# Altium schematic sheet GPIO.SchDoc
size 457 x 457 mm; SheetNumber: 8; SheetTotal: 12
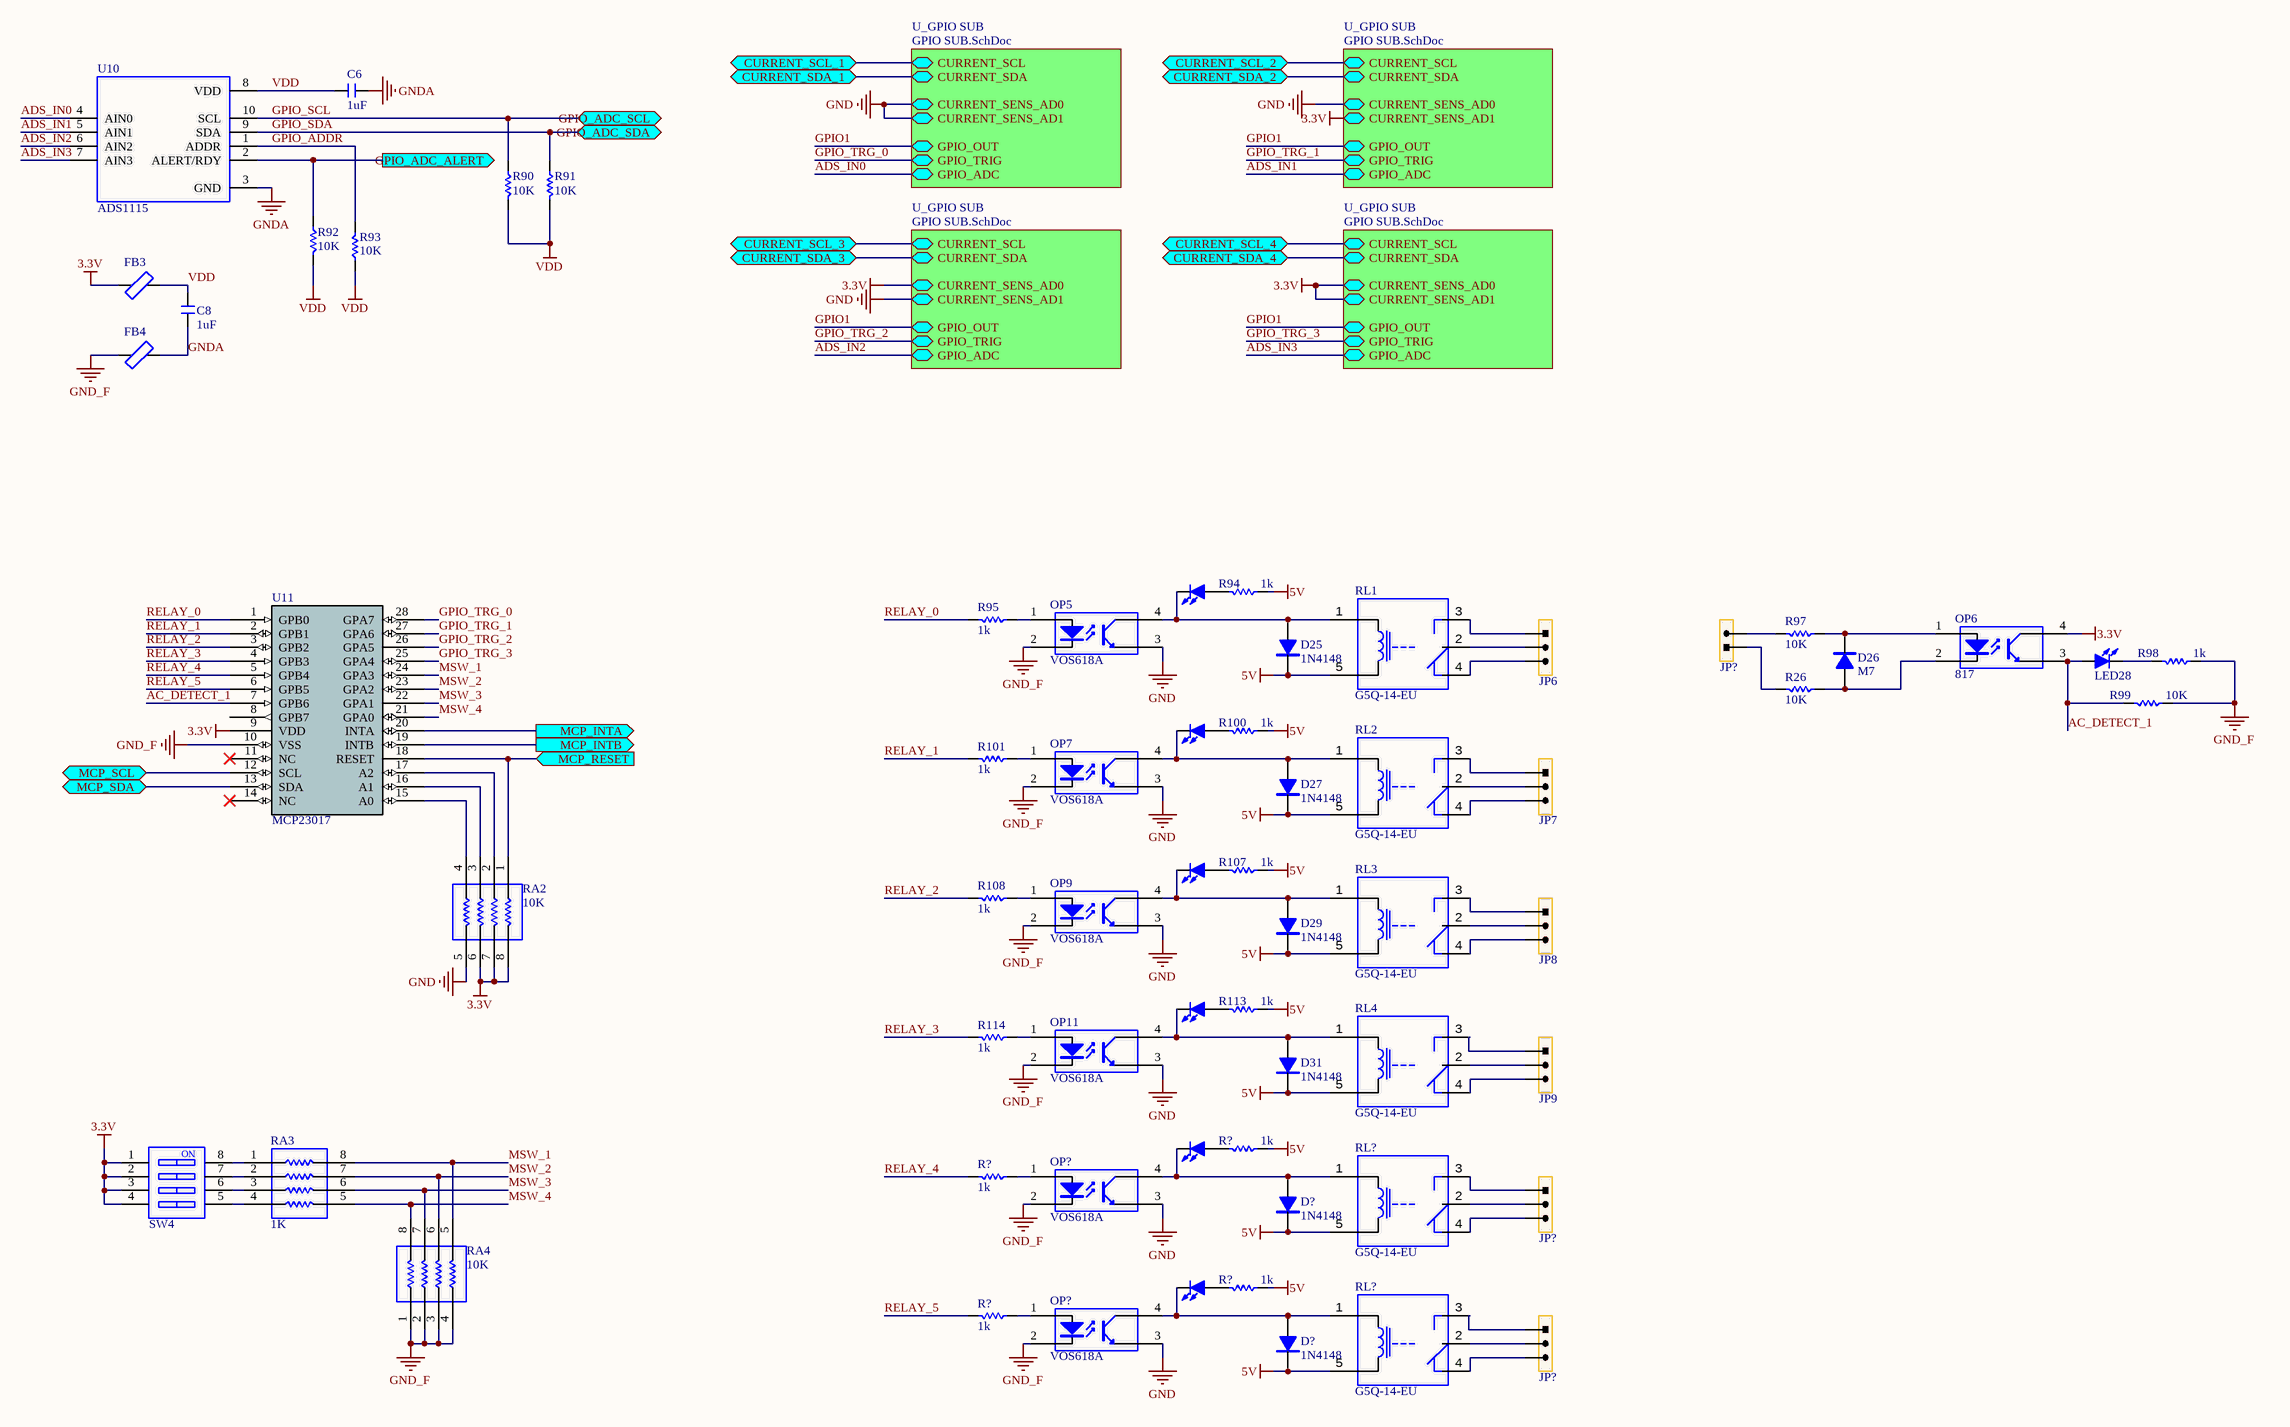
[diagram p0: GPIO.SchDoc]

## Parts
(Parts that share a designator on the sheet are numbered #1, #2 ... from top to bottom, then left to right.)
C6  1uF  [C 0805]
C8  1uF  [C 0805]
D25  1N4148  [SOD-323]
D26  M7  [SMA]
D27  1N4148  [SOD-323]
D29  1N4148  [SOD-323]
D31  1N4148  [SOD-323]
D?#1  1N4148  [SOD-323]
D?#2  1N4148  [SOD-323]
FB3  (no value)  [F 0805]
FB4  (no value)  [F 0805]
JP6  HDR-1X3  [KF-3P-BLK-H-3.81]  (value not drawn)
JP7  HDR-1X3  [KF-3P-BLK-H-3.81]  (value not drawn)
JP8  HDR-1X3  [KF-3P-BLK-H-3.81]  (value not drawn)
JP9  HDR-1X3  [KF-3P-BLK-H-3.81]  (value not drawn)
JP?#1  HDR-1X2  [KF381GR-2]  (value not drawn)
JP?#2  HDR-1X3  [KF-3P-BLK-H-3.81]  (value not drawn)
JP?#3  HDR-1X3  [KF-3P-BLK-H-3.81]  (value not drawn)
LED27  LED-SMD  [LED 0805B]  (value not drawn)
LED28  LED-SMD  [LED 0805B]  (value not drawn)
LED29  LED-SMD  [LED 0805B]  (value not drawn)
LED31  LED-SMD  [LED 0805B]  (value not drawn)
LED33  LED-SMD  [LED 0805B]  (value not drawn)
LED?#1  LED-SMD  [LED 0805B]  (value not drawn)
LED?#2  LED-SMD  [LED 0805B]  (value not drawn)
OP5  VOS618A  [VOS618A-SSOP4]
OP6  817  [PC817-SMD]
OP7  VOS618A  [VOS618A-SSOP4]
OP9  VOS618A  [VOS618A-SSOP4]
OP11  VOS618A  [VOS618A-SSOP4]
OP?#1  VOS618A  [VOS618A-SSOP4]
OP?#2  VOS618A  [VOS618A-SSOP4]
R26  10K  [R 0805]
R90  10K  [R 0805]
R91  10K  [R 0805]
R92  10K  [R 0805]
R93  10K  [R 0805]
R94  1k  [R 0805]
R95  1k  [R 0805]
R97  10K  [R 0805]
R98  1k  [R 0805]
R99  10K  [R 0805]
R100  1k  [R 0805]
R101  1k  [R 0805]
R107  1k  [R 0805]
R108  1k  [R 0805]
R113  1k  [R 0805]
R114  1k  [R 0805]
R?#1  1k  [R 0805]
R?#2  1k  [R 0805]
R?#3  1k  [R 0805]
R?#4  1k  [R 0805]
RA2  10K  [RA1206 (4x0603)]
RA3  1K  [RA1206 (4x0603)]
RA4  10K  [RA1206 (4x0603)]
RL1  G5Q-14-EU  [G5Q-14-EU]
RL2  G5Q-14-EU  [G5Q-14-EU]
RL3  G5Q-14-EU  [G5Q-14-EU]
RL4  G5Q-14-EU  [G5Q-14-EU]
RL?#1  G5Q-14-EU  [G5Q-14-EU]
RL?#2  G5Q-14-EU  [G5Q-14-EU]
SW4  CSW-4P  [CSW DIP-4P_G]  (value not drawn)
U10  ADS1115  [VSSOP10-N]
U11  MCP23017  [SOIC28]

## Sub-sheets
U_GPIO SUB = GPIO SUB.SchDoc: CURRENT_SCL (bidir), CURRENT_SDA (bidir), CURRENT_SENS_AD0 (bidir), CURRENT_SENS_AD1 (bidir), GPIO_OUT (bidir), GPIO_TRIG (bidir), GPIO_ADC (bidir)
U_GPIO SUB = GPIO SUB.SchDoc: CURRENT_SCL (bidir), CURRENT_SDA (bidir), CURRENT_SENS_AD0 (bidir), CURRENT_SENS_AD1 (bidir), GPIO_OUT (bidir), GPIO_TRIG (bidir), GPIO_ADC (bidir)
U_GPIO SUB = GPIO SUB.SchDoc: CURRENT_SCL (bidir), CURRENT_SDA (bidir), CURRENT_SENS_AD0 (bidir), CURRENT_SENS_AD1 (bidir), GPIO_OUT (bidir), GPIO_TRIG (bidir), GPIO_ADC (bidir)
U_GPIO SUB = GPIO SUB.SchDoc: CURRENT_SCL (bidir), CURRENT_SDA (bidir), CURRENT_SENS_AD0 (bidir), CURRENT_SENS_AD1 (bidir), GPIO_OUT (bidir), GPIO_TRIG (bidir), GPIO_ADC (bidir)

## Ports
CURRENT_SCL_1 (bidir), CURRENT_SCL_2 (bidir), CURRENT_SCL_3 (bidir), CURRENT_SCL_4 (bidir), CURRENT_SDA_1 (bidir), CURRENT_SDA_2 (bidir), CURRENT_SDA_3 (bidir), CURRENT_SDA_4 (bidir), GPIO_ADC_ALERT (out), GPIO_ADC_SCL (bidir), GPIO_ADC_SDA (bidir), MCP_INTA (out), MCP_INTB (out), MCP_RESET (in), MCP_SCL (bidir), MCP_SDA (bidir)

## Nets
3.3V: FB3.1 OP6.4(C) RA2.6 RA2.7 RA2.8 SW4.1 SW4.2 SW4.3 SW4.4 U11.9(VDD) ; sheet U_GPIO SUB/CURRENT_SENS_AD0, sheet U_GPIO SUB/CURRENT_SENS_AD1, sheet U_GPIO SUB/CURRENT_SENS_AD0, sheet U_GPIO SUB/CURRENT_SENS_AD1
5V: D25.2(K) D27.2(K) D29.2(K) D31.2(K) D?#1.2(K) D?#2.2(K) R94.1 R100.1 R107.1 R113.1 R?#1.1 R?#3.1 RL1.5(A2) RL2.5(A2) RL3.5(A2) RL4.5(A2) RL?#1.5(A2) RL?#2.5(A2)
GND: OP5.3(E) OP7.3(E) OP9.3(E) OP11.3(E) OP?#1.3(E) OP?#2.3(E) RA2.5 ; sheet U_GPIO SUB/CURRENT_SENS_AD0, sheet U_GPIO SUB/CURRENT_SENS_AD1, sheet U_GPIO SUB/CURRENT_SENS_AD1, sheet U_GPIO SUB/CURRENT_SENS_AD0
GND_F: FB4.1 OP5.2(K) OP7.2(K) OP9.2(K) OP11.2(K) OP?#1.2(K) OP?#2.2(K) R98.1 R99.1 RA4.1 RA4.2 RA4.3 RA4.4 U11.10(VSS)
GNDA: C6.1 C8.1 FB4.2 U10.3(GND)
VDD: C6.2 C8.2 FB3.2 R90.2 R91.2 R92.2 R93.1 U10.8(VDD)
AC_DETECT_1: LED28.1(A) OP6.3(E) R99.2 U11.7(GPB6)
ADS_IN0: U10.4(AIN0) ; sheet U_GPIO SUB/GPIO_ADC
ADS_IN1: U10.5(AIN1) ; sheet U_GPIO SUB/GPIO_ADC
ADS_IN2: U10.6(AIN2) ; sheet U_GPIO SUB/GPIO_ADC
ADS_IN3: U10.7(AIN3) ; sheet U_GPIO SUB/GPIO_ADC
CURRENT_SCL_1: port CURRENT_SCL_1, sheet U_GPIO SUB/CURRENT_SCL
CURRENT_SCL_2: port CURRENT_SCL_2, sheet U_GPIO SUB/CURRENT_SCL
CURRENT_SCL_3: port CURRENT_SCL_3, sheet U_GPIO SUB/CURRENT_SCL
CURRENT_SCL_4: port CURRENT_SCL_4, sheet U_GPIO SUB/CURRENT_SCL
CURRENT_SDA_1: port CURRENT_SDA_1, sheet U_GPIO SUB/CURRENT_SDA
CURRENT_SDA_2: port CURRENT_SDA_2, sheet U_GPIO SUB/CURRENT_SDA
CURRENT_SDA_3: port CURRENT_SDA_3, sheet U_GPIO SUB/CURRENT_SDA
CURRENT_SDA_4: port CURRENT_SDA_4, sheet U_GPIO SUB/CURRENT_SDA
GPIO1: sheet U_GPIO SUB/GPIO_OUT, sheet U_GPIO SUB/GPIO_OUT, sheet U_GPIO SUB/GPIO_OUT, sheet U_GPIO SUB/GPIO_OUT
GPIO_ADC_ALERT: R92.1 U10.2(ALERT/RDY) ; port GPIO_ADC_ALERT
GPIO_ADDR: R93.2 U10.1(ADDR)
GPIO_SCL: R90.1 U10.10(SCL) ; port GPIO_ADC_SCL
GPIO_SDA: R91.1 U10.9(SDA) ; port GPIO_ADC_SDA
GPIO_TRG_0: U11.28(GPA7) ; sheet U_GPIO SUB/GPIO_TRIG
GPIO_TRG_1: U11.27(GPA6) ; sheet U_GPIO SUB/GPIO_TRIG
GPIO_TRG_2: U11.26(GPA5) ; sheet U_GPIO SUB/GPIO_TRIG
GPIO_TRG_3: U11.25(GPA4) ; sheet U_GPIO SUB/GPIO_TRIG
MCP_INTA: U11.20(INTA) ; port MCP_INTA
MCP_INTB: U11.19(INTB) ; port MCP_INTB
MCP_RESET: RA2.1 U11.18(RESET) ; port MCP_RESET
MCP_SCL: U11.12(SCL) ; port MCP_SCL
MCP_SDA: U11.13(SDA) ; port MCP_SDA
MSW_1: RA3.8 RA4.5 U11.24(GPA3)
MSW_2: RA3.7 RA4.6 U11.23(GPA2)
MSW_3: RA3.6 RA4.7 U11.22(GPA1)
MSW_4: RA3.5 RA4.8 U11.21(GPA0)
RELAY_0: R95.2 U11.1(GPB0)
RELAY_1: R101.2 U11.2(GPB1)
RELAY_2: R108.2 U11.3(GPB2)
RELAY_3: R114.2 U11.4(GPB3)
RELAY_4: R?#2.2 U11.5(GPB4)
RELAY_5: R?#4.2 U11.6(GPB5)
NetD25_1: D25.1(A) LED27.2(K) OP5.4(C) RL1.1(A1)
NetD26_1: D26.1(A) OP6.2(K) R26.1
NetD26_2: D26.2(K) OP6.1(A) R97.1
NetD27_1: D27.1(A) LED29.2(K) OP7.4(C) RL2.1(A1)
NetD29_1: D29.1(A) LED31.2(K) OP9.4(C) RL3.1(A1)
NetD31_1: D31.1(A) LED33.2(K) OP11.4(C) RL4.1(A1)
NetD?#1_1: D?#1.1(A) LED?#1.2(K) OP?#1.4(C) RL?#1.1(A1)
NetD?#2_1: D?#2.1(A) LED?#2.2(K) OP?#2.4(C) RL?#2.1(A1)
NetJP6_1: JP6.1 RL1.3
NetJP6_2: JP6.2 RL1.2
NetJP6_3: JP6.3 RL1.4
NetJP7_1: JP7.1 RL2.3
NetJP7_2: JP7.2 RL2.2
NetJP7_3: JP7.3 RL2.4
NetJP8_1: JP8.1 RL3.3
NetJP8_2: JP8.2 RL3.2
NetJP8_3: JP8.3 RL3.4
NetJP9_1: JP9.1 RL4.3
NetJP9_2: JP9.2 RL4.2
NetJP9_3: JP9.3 RL4.4
NetJP?#1_1: JP?#1.1 R26.2
NetJP?#1_2: JP?#1.2 R97.2
NetJP?#2_1: JP?#2.1 RL?#1.3
NetJP?#2_2: JP?#2.2 RL?#1.2
NetJP?#2_3: JP?#2.3 RL?#1.4
NetJP?#3_1: JP?#3.1 RL?#2.3
NetJP?#3_2: JP?#3.2 RL?#2.2
NetJP?#3_3: JP?#3.3 RL?#2.4
NetLED27_1: LED27.1(A) R94.2
NetLED28_2: LED28.2(K) R98.2
NetLED29_1: LED29.1(A) R100.2
NetLED31_1: LED31.1(A) R107.2
NetLED33_1: LED33.1(A) R113.2
NetLED?#1_1: LED?#1.1(A) R?#1.2
NetLED?#2_1: LED?#2.1(A) R?#3.2
NetOP5_1: OP5.1(A) R95.1
NetOP7_1: OP7.1(A) R101.1
NetOP9_1: OP9.1(A) R108.1
NetOP11_1: OP11.1(A) R114.1
NetOP?#1_1: OP?#1.1(A) R?#2.1
NetOP?#2_1: OP?#2.1(A) R?#4.1
NetRA2_2: RA2.2 U11.17(A2)
NetRA2_3: RA2.3 U11.16(A1)
NetRA2_4: RA2.4 U11.15(A0)
NetRA3_1: RA3.1 SW4.8
NetRA3_2: RA3.2 SW4.7
NetRA3_3: RA3.3 SW4.6
NetRA3_4: RA3.4 SW4.5

Not connected (* = marked no-connect by the designer): U11 8(GPB7) 11(NC)* 14(NC)*

## Notes on the sheet
- (in symbol CSW-4P) NO

## Library data of the parts
C6 C8 = C: Non-polar patch capacitor; BOM名称: 无极性贴片电容; 版权归属: 源创客; 学习资源: www.ooocke.com
D25 D27 D29 D31 D?#1 D?#2 = 1N4148: High speed switching diode; BOM名称: 高速开关二极管; 版权归属: 源创客; 学习资源: www.ooocke.com
D26 = M7: Rectifier diode; BOM名称: 整流二极管; 版权归属: 源创客; 学习资源: www.ooocke.com
FB3 FB4 = FB: Ferrite Bead; BOM名称: 贴片电阻; 版权归属: 源创客; 学习资源: www.ooocke.com
JP6-JP9 JP?#2 JP?#3 = Header 3: 3P Connector; BOM名称: 3P接插件; 版权归属: 源创客; 学习资源: www.ooocke.com
JP?#1 = Header 2: 2P Connector; BOM名称: 2P接插件; 版权归属: 源创客; 学习资源: www.ooocke.com
LED27-LED29 LED31 LED33 LED?#1 LED?#2 = LED-SMD: Patch LED; BOM名称: 贴片LED; 版权归属: 源创客; 学习资源: www.ooocke.com
OP6 = 817: AC Input Photocoupler; BOM名称: 线性光耦; 版权归属: 源创客; 学习资源: www.ooocke.com
R26 R90-R95 R97-R101 R107 R108 R113 R114 R?#1-R?#4 = R: Chip resistor; 版权归属: 源创客; BOM名称: Chip resistor; 学习资源: www.ooocke.com
RA2-RA4 = R-ARR: 4 way Chip Resistor Array
SW4 = CSW-4P: 4-way code switch; BOM名称: 4路编码开关; 版权归属: 源创客; 学习资源: www.ooocke.com
U10 = ADS1115: ADS111x Ultra-Small, Low-Power, I / 2C-Compatible, 860-SPS, 16-Bit ADCs / With Internal Reference, Oscillator, and Programmable Comparator; BOM名称: 数字电位器; 版权归属: 源创客; 学习资源: www.ooocke.com